# Altium schematic sheet PDMC-S04-V00-TempSensor.SchDoc: Temperature Sensor
size A3; DrawnBy: Zoe Goodward; Organization: QUT Motorsport; Address1: O-120, Gardens Point; Address2: 2 George Street; Address3: Brisbane, QLD 4000; Address4: Australia; DocumentNumber: 4; Revision: 01; SheetNumber: 4; SheetTotal: 6; Version: 01; Project: Power Distribution Module Card; PageSetup: Record=PageOptions|CenterHorizontal=True|CenterVertical=True|PrintScale=0.97|XCorrection=1.00|YCorrection=1.00|PrintKind=0|BorderSize=5000000|LeftOffset=0|BottomOffset=0|Orientation=2|PaperLength=1000|PaperWidth=1000|Scale=100|PaperSource=7|PrintQuality=-4|MediaType=1|DitherType=10|PaperKind=A4|PrintScaleMode=1
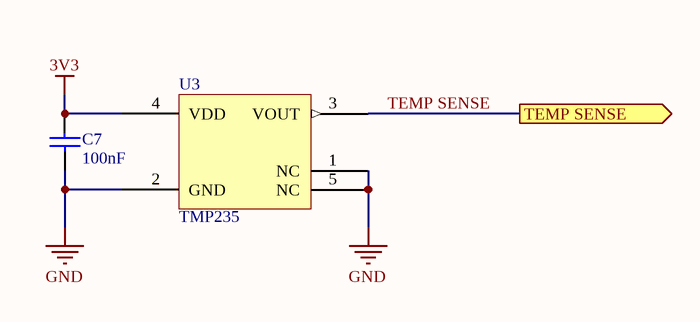
[diagram p0: PDMC-S04-V00-TempSensor.SchDoc]

## Parts
C7  100nF  [Cap_Ceramic_0603]
U3  TMP235  [SC70]

## Ports
TEMP SENSE (out)

## Nets
3V3: C7.2 U3.4(VDD)
GND: C7.1 U3.1(NC) U3.2(GND) U3.5(NC)
TEMP SENSE: U3.3(VOUT) ; port TEMP SENSE

## Notes on the sheet
- Revision History:
- Sheet Title:
- Rev
- Date
- Description
- Project:
- Size:
- Drawn By:
- A3
- Number:
- Revision:
- Sheet
- Version:
- of
- QUT Motorsport
- O-120, Gardens Point
- 2 George Street
- Brisbane, QLD 4000
- Australia
- Print Date:
- Print Time:
- File Name:

## Library data of the parts
C7 = 100nF 50V 5% X7R 0603: Capacitor, Ceramic, SMD, 100nF, 50V, 5%, X7R, 0603
U3 = TMP235: TMP235, Low-Power, High-Accuracy Analog Output Temperature Sensor; ComponentLink1Description: Datasheet; ComponentLink1URL: https://www.ti.com/lit/ds/symlink/tmp235.pdf?HQS=TI-null-null-digikeymode-df-pf-null-wwe&ts=1595645947985; ComponentLink2Description: Digikey; ComponentLink2URL: https://www.digikey.com.au/product-detail/en/texas-instruments/TMP235A4DCKR/296-50016-1-ND/9462854